# Altium project NaviGo v3.0.PrjPcb
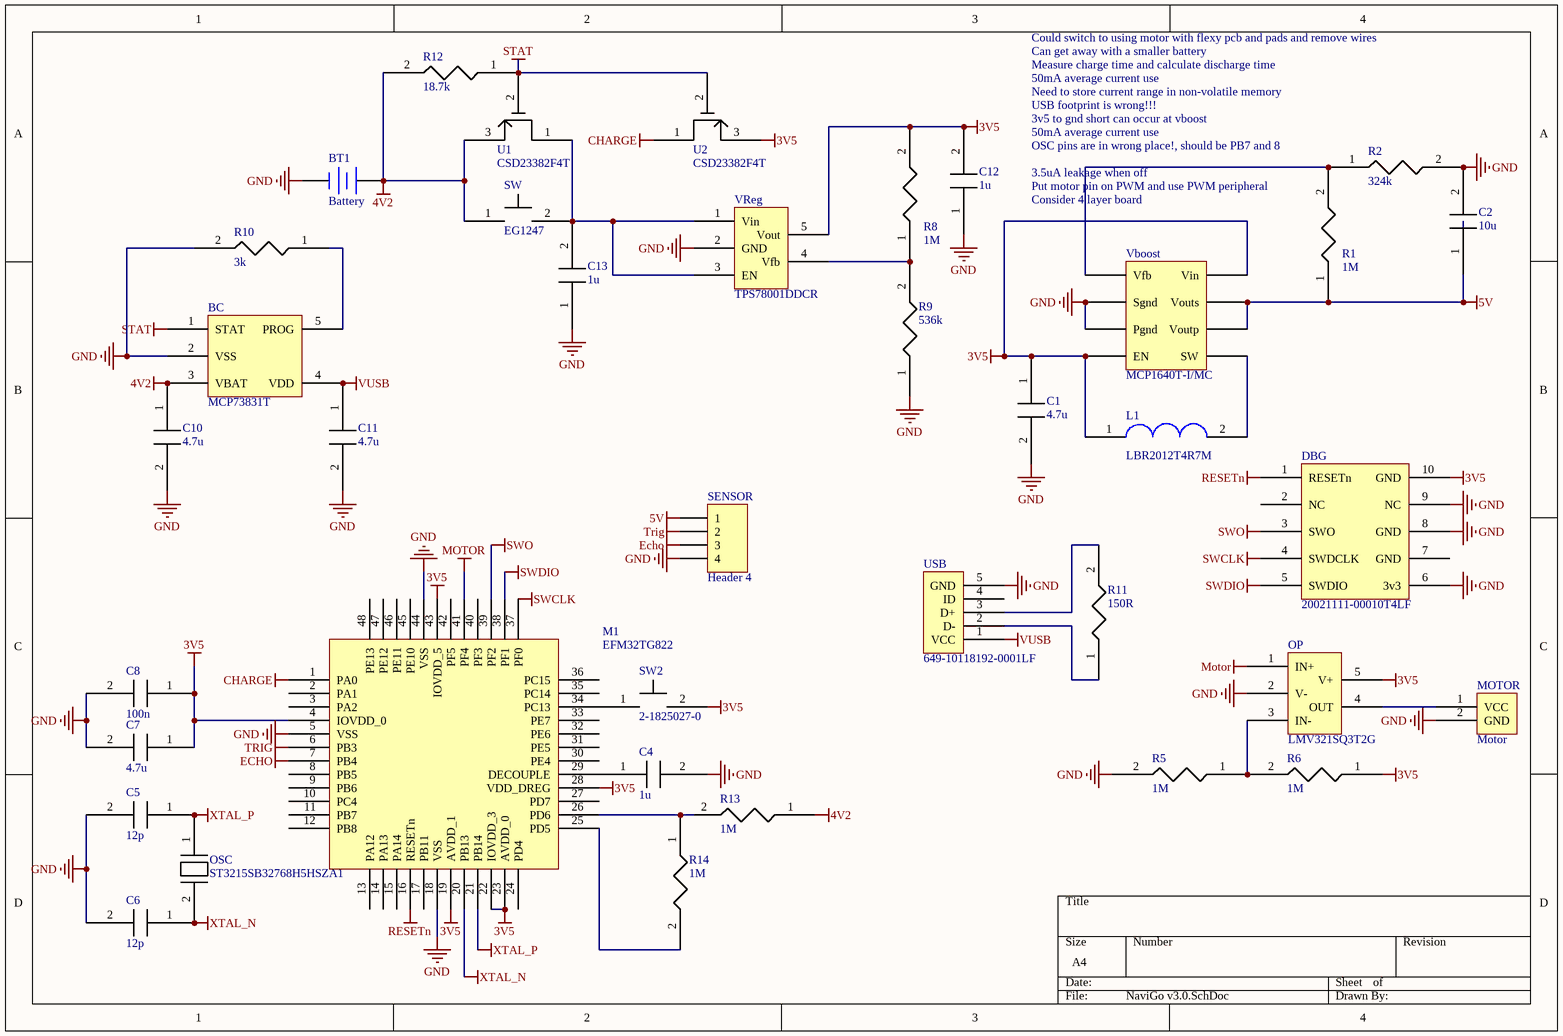
[diagram p0: NaviGo v3.0.SchDoc]
1 sheet, 38 parts. Net scope: global (net labels, ports and power ports of the same name join across sheets).
Board files: NaviGo v3.0.PcbDoc, NaviGo v3.0 Single Board.PcbDoc

## Sheet NaviGo v3.0.SchDoc: Sensor Module Schematic
size A4; DrawnBy: Ian Glass; Engineer: Ian Glass

### Parts
BC  MCP73831T  [MCP73831T]
BT1  Battery  [BAT-2]
C1  4.7u  [Capacitor 0805]
C2  10u  [Capacitor 0805]
C4  1u  [Capacitor 0402]
C5  12p  [Capacitor 0402]
C6  12p  [Capacitor 0402]
C7  4.7u  [Capacitor 0805]
C8  100n  [Capacitor 0402]
C10  4.7u  [Capacitor 0805]
C11  4.7u  [Capacitor 0805]
C12  1u  [Capacitor 0402]
C13  1u  [Capacitor 0402]
DBG  20021111-00010T4LF  [20021111-00010T4LF]
L1  LBR2012T4R7M  [LBR2012T4R7M]
M1  EFM32TG822  [EFM32TG822]
MOTOR  Motor  [Motor]
OP  LMV321SQ3T2G  [LMV321SQ3T2G]
OSC  ST3215SB32768H5HSZA1  [ST3215SB32768H5HSZA1]
R1  1M  [Resistor 0403]
R2  324k  [Resistor 0603]
R5  1M  [Resistor 0403]
R6  1M  [Resistor 0403]
R8  1M  [Resistor 0403]
R9  536k  [Resistor 0603]
R10  3k  [Resistor 0603]
R11  150R  [Resistor 0603]
R12  18.7k  [Resistor 0403]
R13  1M  [Resistor 0403]
R14  1M  [Resistor 0403]
SENSOR  Header 4  [HDR1X4]
SW  EG1247  [EG1247]
SW2  2-1825027-0  [2-1825027-0]
U1  CSD23382F4T  [CSD23382F4T]
U2  CSD23382F4T  [CSD23382F4T]
USB  649-10118192-0001LF  [649-10118192-0001LF]
Vboost  MCP1640T-I/MC  [MCP1640T-I/MC]
VReg  TPS78001DDCR  [TPS78001DDCR]

### Nets
3V5: C1.1 C7.1 C8.1 C12.2 DBG.10(GND) L1.1 M1.4(IOVDD_0) M1.19(AVDD_1) M1.22(IOVDD_3) M1.23(AVDD_0) M1.28(VDD_DREG) M1.43(IOVDD_5) OP.5(V+) R6.1 R8.2 SW2.2 U2.3 Vboost.4(EN) Vboost.8(Vin) VReg.5(Vout)
4V2: BC.3(VBAT) BT1.1(+) C10.1 R12.2 R13.1 SW.1 U1.3
5V: C2.1 R1.1 SENSOR.1 Vboost.6(Voutp) Vboost.7(Vouts)
CHARGE: M1.1(PA0) U2.1
Echo: M1.7(PB4) SENSOR.3
GND: BC.2(VSS) BT1.2(-) C1.2 C2.2 C4.2 C5.2 C6.2 C7.2 C8.2 C10.2 C11.2 C12.1 C13.1 DBG.6(3v3) DBG.8(GND) DBG.9(NC) M1.5(VSS) M1.18(VSS) M1.44(VSS) MOTOR.2(GND) OP.2(V-) R2.2 R5.2 R9.1 R10.2 SENSOR.4 USB.5(GND) Vboost.2(Sgnd) Vboost.3(Pgnd) VReg.2(GND)
MOTOR: M1.41(PF4) OP.1(IN+)
RESETn: DBG.1(RESETn) M1.16(RESETn)
STAT: BC.1(STAT) R12.1 U1.2 U2.2
SWCLK: DBG.4(SWDCLK) M1.37(PF0)
SWDIO: DBG.5(SWDIO) M1.38(PF1)
SWO: DBG.3(SWO) M1.39(PF2)
Trig: M1.6(PB3) SENSOR.2
VUSB: BC.4(VDD) C11.1 USB.1(VCC)
XTAL_N: C6.1 M1.20(PB13) OSC.2
XTAL_P: C5.1 M1.21(PB14) OSC.1
NetBC_5: BC.5(PROG) R10.1
NetC4_1: C4.1 M1.29(DECOUPLE)
NetC13_2: C13.2 SW.2 U1.1 VReg.1(Vin) VReg.3(EN)
NetL1_2: L1.2 Vboost.5(SW)
NetM1_25: M1.25(PD5) R14.2
NetM1_26: M1.26(PD6) R13.2 R14.1
NetM1_34: M1.34(PC13) SW2.1
NetMOTOR_1: MOTOR.1(VCC) OP.4(OUT)
NetOP_3: OP.3(IN-) R5.1 R6.2
NetR1_2: R1.2 R2.1 Vboost.1(Vfb)
NetR8_1: R8.1 R9.2 VReg.4(Vfb)
NetR11_1: R11.1 USB.2(D-)
NetR11_2: R11.2 USB.3(D+)

Not connected (* = marked no-connect by the designer): DBG 2(NC) 7(GND); M1 2(PA1) 3(PA2) 8(PB5) 9(PB6) 10(PC4) 11(PB7) 12(PB8) 13(PA12) 14(PA13) 15(PA14) 17(PB11) 24(PD4) 27(PD7) 30(PE4) 31(PE5) 32(PE6) 33(PE7) 35(PC14) 36(PC15) 40(PF3) 42(PF5) 45(PE10) 46(PE11) 47(PE12) 48(PE13); USB 4(ID)

### Notes on the sheet
- Could switch to using motor with flexy pcb and pads and remove wires
- Can get away with a smaller battery
- Measure charge time and calculate discharge time
- 50mA average current use
- Need to store current range in non-volatile memory
- USB footprint is wrong!!!
- 3v5 to gnd short can occur at vboost
- OSC pins are in wrong place!, should be PB7 and 8
- 3.5uA leakage when off
- (near R1) Put motor pin on PWM and use PWM peripheral
- Consider 4 layer board

### Library data of the parts
BT1 = Battery: Multicell Battery; Published: 24-Mar-1999; LatestRevisionDate: 17-Jul-2002; LatestRevisionNote: Re-released for DXP Platform.; PackageReference: BAT-2; Publisher: Altium Limited; PackageDescription: Battery; 2 Leads
C1 C2 C7 C10 C11 = Capacitor 0805
C4-C6 C8 C12 C13 = Capacitor 0402
R1 R5 R6 R8 R12-R14 = Resistor 0403
R2 R9-R11 = Resistor 0603
SENSOR = Header 4: Header, 4-Pin; LatestRevisionDate: 17-Jul-2002; LatestRevisionNote: Re-released for DXP Platform.; Publisher: Altium Limited